# EAGLE design icetube (EAGLE 5.01)
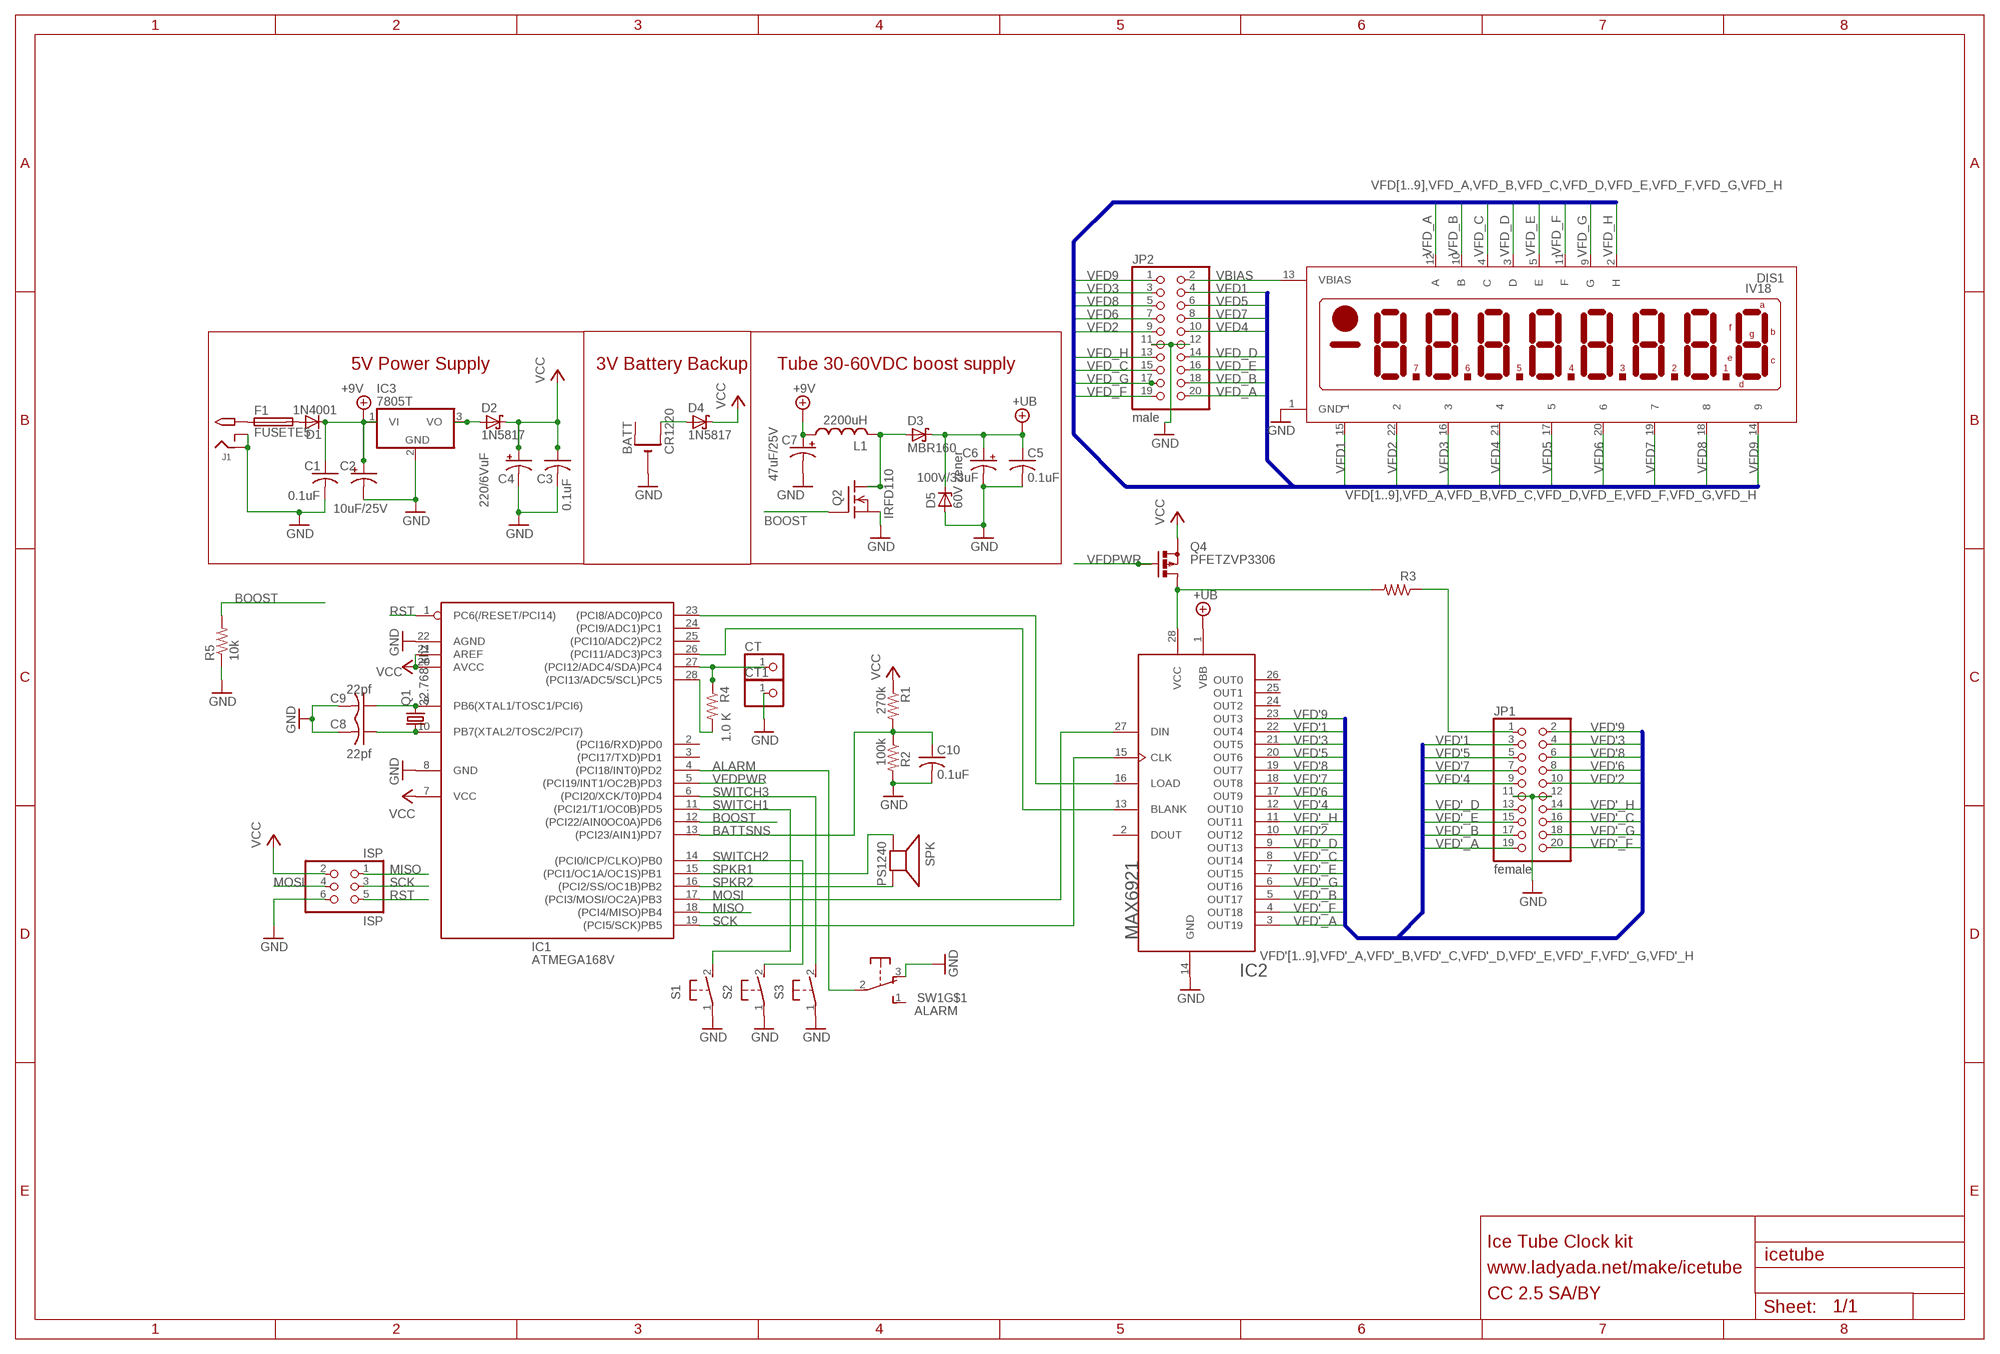
[diagram p0: schematic, sheet 1]

## Parts
BATT  CR1220  CR1220THM  [CR1220-THM]
C1  0.1uF  C-US025-025X050  [C025-025X050]
C2  10uF/25V  CPOL-USE2.5-6  [E2,5-6]
C3  0.1uF  C-US025-025X050  [C025-025X050]
C4  220/6VuF  CPOL-USE2.5-6  [E2,5-6]
C5  0.1uF  C-US025-024X044  [C025-024X044]
C6  100V/33uF  CPOL-USE3.5-8  [E3,5-8]
C7  47uF/25V  CPOL-USE2.5-6  [E2,5-6]
C8  22pf  C-US025-025X050  [C025-025X050]
C9  22pf  C-US025-025X050  [C025-025X050]
C10  0.1uF  C-US025-024X044  [C025-024X044]
CT  PINHD-1X1  [1X01]
CT1  PINHD-1X1  [1X01]
D1  1N4001  1N4004  [DO41-10]
D2  1N5817  SCHOTTKY-DIODEDO41  [DO41-10]
D3  MBR160  SCHOTTKY-DIODEDO41  [DO41-10]
D4  1N5817  SCHOTTKY-DIODEDO41  [DO41-10]
D5  60V zener  ZENER-DIODEDO41Z10  [DO41Z10]
DIS1  IV18  [IV18]
F1  FUSETE5  [TE5]
IC1  ATMEGA168V  ATMEGA168PROUND  [DIL28/3]
IC2  MAX6921  [PLCC-S28]
IC3  7805T  [TO220H]
ISP  ISP  PINHD-2X3  [2X03]
J1  2.1MMJACK  [PJ-102A]
JP1  female  PINHD-2X10  [2X10]
JP2  male  PINHD-2X10  [2X10]
L1  2200uH  L  [6000]
Q1  32.768 khz  CRYTALTC26V  [TC26V]
Q2  IRFD110  [DIL04]
Q4  PFETZVP3306  [TO92-OVAL]
R1  270k  R-US_0207/10  [0207/10]
R2  100k  R-US_0207/10  [0207/10]
R3  22  R-US_0207/10  [0207/10]
R4  1.0 K  R-US_0207/5V  [0207/5V]
R5  10k  R-US_0207/5V  [0207/5V]
S1  31-XX  [B3F-31XX]
S2  31-XX  [B3F-31XX]
S3  31-XX  [B3F-31XX]
SPK  PS1240  SPEAKER/PS12  [PS12]
SW1  ALARM  OS102011MA1Q  [OS102011MA1Q]

## Nets
+9V: C1.1 C2.+ C7.+ D1.C IC3.1(VI) L1.1
+UB: C5.1 C6.+ D3.C D5.C IC2.1(VBB)
ALARM: IC1.4((PCI18/INT0)PD2) SW1.2(P)
BATTSNS: C10.1 IC1.13((PCI23/AIN1)PD7) R1.2 R2.1
BLANK: IC1.26((PCI11/ADC3)PC3) IC2.13(BLANK)
BOOST: IC1.12((PCI22/AIN0OC0A)PD6) Q2.3(G) R5.2
GND: BATT.- C1.2 C2.- C3.2 C4.- C5.2 C6.- C7.- C8.2 C9.2 C10.2 CT1.1 D5.A DIS1.1(GND) IC1.8(GND) IC1.22(AGND) IC2.14(GND) IC3.2(GND) ISP.6 J1.RING J1.RING_SW JP1.11 JP1.12 JP2.11 JP2.12 Q2.4(S) R2.2 R5.1 S1.1(P) S2.1(P) S3.1(P) SW1.3(O)
LOAD: IC1.23((PCI8/ADC0)PC0) IC2.16(LOAD)
MISO: IC1.18((PCI4/MISO)PB4) ISP.1
MOSI: IC1.17((PCI3/MOSI/OC2A)PB3) IC2.27(DIN) ISP.4
N$1: C9.1 IC1.9(PB6(XTAL1/TOSC1/PCI6)) Q1.2
N$2: D3.A L1.2 Q2.1(D) Q2.2(D1)
N$3: C8.1 IC1.10(PB7(XTAL2/TOSC2/PCI7)) Q1.1
N$4: F1.1 J1.TIP
N$5: D1.A F1.2
N$10: BATT.+2(+1) D4.A
N$11: IC1.28((PCI13/ADC5/SCL)PC5) R4.2
N$34: JP1.1 R3.1
N$39: IC2.28(VCC) Q4.3(D) R3.2
N$52: CT.1 IC1.27((PCI12/ADC4/SDA)PC4) R4.1
N$53: D2.A IC3.3(VO)
RST: IC1.1(PC6(/RESET/PCI14)) ISP.5
SCK: IC1.19((PCI5/SCK)PB5) IC2.15(CLK) ISP.3
SPKR1: IC1.15((PCI1/OC1A/OC1S)PB1) SPK.P$1(+)
SPKR2: IC1.16((PCI2/SS/OC1B)PB2) SPK.P$2(-)
SWITCH1: IC1.11((PCI21/T1/OC0B)PD5) S1.2(S)
SWITCH2: IC1.14((PCI0/ICP/CLKO)PB0) S2.2(S)
SWITCH3: IC1.6((PCI20/XCK/T0)PD4) S3.2(S)
VBIAS: DIS1.13(VBIAS) JP2.2
VCC: C3.1 C4.+ D2.C D4.C IC1.7(VCC) IC1.20(AVCC) IC1.21(AREF) ISP.2 Q4.1(S) R1.1
VFD1: DIS1.15 JP2.4
VFD2: DIS1.22 JP2.9
VFD3: DIS1.16 JP2.3
VFD4: DIS1.21 JP2.10
VFD5: DIS1.17 JP2.6
VFD6: DIS1.20 JP2.7
VFD7: DIS1.19 JP2.8
VFD8: DIS1.18 JP2.5
VFD9: DIS1.14 JP2.1
VFD'1: IC2.22(OUT4) JP1.3
VFD'2: IC2.10(OUT12) JP1.10
VFD'3: IC2.21(OUT5) JP1.4
VFD'4: IC2.12(OUT10) JP1.9
VFD'5: IC2.20(OUT6) JP1.5
VFD'6: IC2.17(OUT9) JP1.8
VFD'7: IC2.18(OUT8) JP1.7
VFD'8: IC2.19(OUT7) JP1.6
VFD'9: IC2.23(OUT3) JP1.2
VFD'_A: IC2.3(OUT19) JP1.19
VFD'_B: IC2.5(OUT17) JP1.17
VFD'_C: IC2.8(OUT14) JP1.16
VFD'_D: IC2.9(OUT13) JP1.13
VFD'_E: IC2.7(OUT15) JP1.15
VFD'_F: IC2.4(OUT18) JP1.20
VFD'_G: IC2.6(OUT16) JP1.18
VFD'_H: IC2.11(OUT11) JP1.14
VFD_A: DIS1.12(A) JP2.20
VFD_B: DIS1.10(B) JP2.18
VFD_C: DIS1.4(C) JP2.15
VFD_D: DIS1.3(D) JP2.14
VFD_E: DIS1.5(E) JP2.16
VFD_F: DIS1.11(F) JP2.19
VFD_G: DIS1.9(G) JP2.17
VFD_H: DIS1.2(H) JP2.13
VFDPWR: IC1.5((PCI19/INT1/OC2B)PD3) Q4.2(G)
Unconnected: BATT.+1(+) IC1.2((PCI16/RXD)PD0) IC1.3((PCI17/TXD)PD1) IC1.24((PCI9/ADC1)PC1) IC1.25((PCI10/ADC2)PC2) IC2.2(DOUT) IC2.24(OUT2) IC2.25(OUT1) IC2.26(OUT0) SW1.1(S) SW1.MT1(MT) SW1.MT2(MT)

## Buses
VFD[1..9],VFD_A,VFD_B,VFD_C,VFD_D,VFD_E,VFD_F,VFD_G,VFD_H
VFD'[1..9],VFD'_A,VFD'_B,VFD'_C,VFD'_D,VFD'_E,VFD'_F,VFD'_G,VFD'_H

## Notes on the sheet
- 5V Power Supply | 3V Battery Backup | Tube 30-60VDC boost supply
- Ice Tube Clock kit
- www.ladyada.net/make/icetube
- CC 2.5 SA/BY

## Library data of the parts
BATT = vfd:CR1220
C1 C3 C8 C9 = minimidi:C-US: CAPACITOR, American symbol
C2 C4 C7 = minimidi:CPOL-US: POLARIZED CAPACITOR, American symbol
C5 C10 = rcl-ez:C-US: CAPACITOR, American symbol
C6 = rcl-ez:CPOL-US: POLARIZED CAPACITOR, American symbol
CT CT1 = ybox2:PINHD-1X1: PIN HEADER
D1 = minimidi:1N4004: DIODE general purpose rectifier, 1 A
D2-D4 = usbbuck:SCHOTTKY-DIODE: Schottky Diode
D5 = diode:ZENER-DIODE: Z-Diode
DIS1 = vfd:IV18: LCD DISPLAY 8-character 7 segment
F1 = fuse:FUSE: Fuse
IC1 = avr:ATMEGA168*P: MICROCONTROLLER 16 kBytes FLASH 1 kBytes SRAM 512 Bytes EEPROM USART 8-channel 10 bit ADC
IC2 = vfd:MAX6921
IC3 = linear:78*: Positive VOLTAGE REGULATOR
ISP = pinhead-ez:PINHD-2X3: PIN HEADER
J1 = minimidi:2.1MMJACK
JP1 JP2 = pinhead:PINHD-2X10: PIN HEADER
L1 = usbbuck:L
Q1 = crystal:CRYTAL: CRYSTAL
Q2 = vfd:IRFD110
Q4 = adafruit:PFET: P-CHANNEL MOS FET
R1-R5 = minimidi:R-US_: RESISTOR, American symbol
S1-S3 = switch-omron:31-XX: OMRON SWITCH
SPK = ybox2:SPEAKER: SPEAKER Source: Buerklin
SW1 = adaprog:OS102011MA1Q

## Board
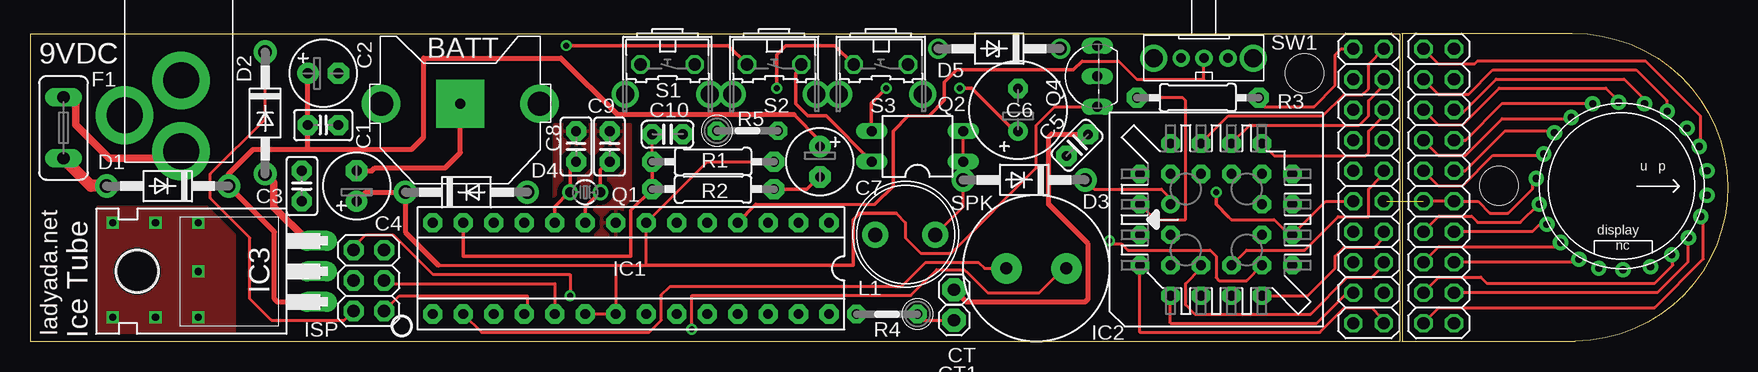
[diagram p1: board, top side]
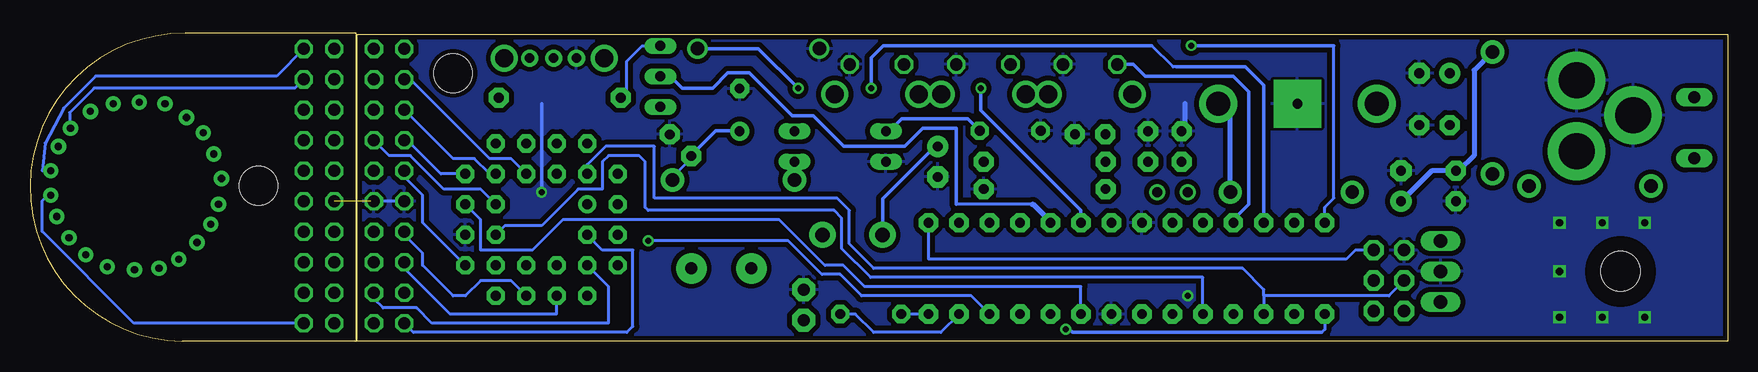
[diagram p2: board, bottom side, seen from below]

Size 141.47 x 25.68 mm. Coordinates in mm from the lower left corner, seen from the top.
Outline: 114.34,25.65 114.34,0
Outline: 114.3,0.03 128.77,0.03 arc180 128.52,25.68 114.3,25.68
Outline: 0,0.04 114.2,0.04 114.2,25.62 0,25.62 0,0.04
Copper layers (1*16): Top 0.035mm / dielectric 1.5mm / Bottom 0.035mm
Design rules "default *": minimum track width 10mil, minimum drill 19mil, track to track 12mil, track to pad 12mil, pad to pad 20mil, via to via 12mil, smd to smd 0mil, copper to edge 12mil, drill to drill 8mil, minimum pad ring 10mil, minimum via ring 8mil, stop-mask expansion 4mil, vias tented up to drill 20mil, thermal gap 10mil
Holes 3.2 mm at 106.21,22.35 122.42,12.98

### Footprints (pad centres in the part's own frame; a part is rotated, then mirrored left to right if it is on the bottom)
CR1220-THM = drill 2 pad 3.175 round: +1 -6.604,0; +2 6.604,0 | drill 0.8 pad 3.962 square: - 0,0
C025-025X050 = drill 0.813 pad 1.676 octagon: 1 -1.27,0; 2 1.27,0
E2,5-6 = drill 0.813 pad 1.778 round: + -1.27,0 | drill 0.813 pad 1.778 octagon: - 1.27,0
C025-024X044 = drill 0.813 pad 1.676 octagon: 1 -1.27,0; 2 1.27,0
E3,5-8 = drill 0.813 pad 1.6 round: + -1.778,0 | drill 0.813 pad 1.6 octagon: - 1.778,0
1X01 = drill 1.016 pad 1.93 octagon: 1 0,0
DO41-10 = drill 1.118 pad 1.93 round: A 5.08,0; C -5.08,0
DO41Z10 = drill 1.118 round: A 5.08,0; C -5.08,0
IV18 = drill 0.6 pad 1.27 round: 1 -0.635,-7.112; 2 1.524,-6.858; 3 3.175,-6.223; 4 4.699,-5.08; 5 6.096,-3.556; 6 6.858,-1.905; 7 6.985,0.127; 8 6.731,2.413; 9 5.715,4.191; 10 4.318,5.588; 11 2.54,6.604; 12 0.762,7.112; 13 -1.27,7.112; 14 -3.302,6.477; 15 -4.826,5.461; 16 -6.223,3.81; 17 -6.858,1.905; 18 -6.985,-0.254; 19 -6.858,-2.413; 20 -5.715,-4.191; 21 -4.445,-5.588; 22 -2.667,-6.477
TE5 = drill 1.016 long: 1 -2.54,0; 2 2.54,0
DIL28/3 = drill 0.813 pad 1.6 octagon: 1 -16.51,-3.81; 2 -13.97,-3.81; 3 -11.43,-3.81; 4 -8.89,-3.81; 5 -6.35,-3.81; 6 -3.81,-3.81; 7 -1.27,-3.81; 8 1.27,-3.81; 9 3.81,-3.81; 10 6.35,-3.81; 11 8.89,-3.81; 12 11.43,-3.81; 13 13.97,-3.81; 14 16.51,-3.81; 15 16.51,3.81; 16 13.97,3.81; 17 11.43,3.81; 18 8.89,3.81; 19 6.35,3.81; 20 3.81,3.81; 21 1.27,3.81; 22 -1.27,3.81; 23 -3.81,3.81; 24 -6.35,3.81; 25 -8.89,3.81; 26 -11.43,3.81; 27 -13.97,3.81; 28 -16.51,3.81
PLCC-S28 = drill 0.813 pad 1.524 round: 1 1.27,3.81 | drill 0.813 pad 1.524 octagon: 2 -1.27,6.35; 3 -1.27,3.81; 4 -3.81,6.35; 5 -6.35,3.81; 6 -3.81,3.81; 7 -6.35,1.27; 8 -3.81,1.27; 9 -6.35,-1.27; 10 -3.81,-1.27; 11 -6.35,-3.81; 12 -3.81,-6.35; 13 -3.81,-3.81; 14 -1.27,-6.35; 15 -1.27,-3.81; 16 1.27,-6.35; 17 1.27,-3.81; 18 3.81,-6.35; 19 6.35,-3.81; 20 3.81,-3.81; 21 6.35,-1.27; 22 3.81,-1.27; 23 6.35,1.27; 24 3.81,1.27; 25 6.35,3.81; 26 3.81,6.35; 27 3.81,3.81; 28 1.27,6.35
TO220H = drill 1.118 long: 1 -2.54,-10.16; 2 0,-10.16; 3 2.54,-10.16 | hole 3.302: 0,4.826
2X03 = drill 1.016 pad 1.676 octagon: 1 -2.54,-1.27; 2 -2.54,1.27; 3 0,-1.27; 4 0,1.27; 5 2.54,-1.27; 6 2.54,1.27
PJ-102A = drill 3 pad 4.8 round: RING 0.1,-3.39; RING_SW -4.6,-6.29; TIP 0.1,-9.29
2X10 = drill 1.016 octagon: 1 -11.43,-1.27; 2 -11.43,1.27; 3 -8.89,-1.27; 4 -8.89,1.27; 5 -6.35,-1.27; 6 -6.35,1.27; 7 -3.81,-1.27; 8 -3.81,1.27; 9 -1.27,-1.27; 10 -1.27,1.27; 11 1.27,-1.27; 12 1.27,1.27; 13 3.81,-1.27; 14 3.81,1.27; 15 6.35,-1.27; 16 6.35,1.27; 17 8.89,-1.27; 18 8.89,1.27; 19 11.43,-1.27; 20 11.43,1.27
6000 = drill 1.2 pad 2.184 round: 1 -2.5,0; 2 2.5,0
TC26V = drill 0.813 round: 1 -1.27,0; 2 1.27,0
DIL04 = drill 0.813 long: 1 -1.27,-3.81; 2 1.27,-3.81; 3 1.27,3.81; 4 -1.27,3.81
TO92-OVAL = drill 0.813 long: 1 -2.54,0; 2 0,0; 3 2.54,0
0207/10 = drill 0.813 pad 1.676 octagon: 1 -5.08,0; 2 5.08,0
0207/5V = drill 0.813 pad 1.524 octagon: 1 -2.54,0; 2 2.54,0
B3F-31XX = drill 1.016 octagon: 1 -2.261,-1.245; 2 2.261,-1.245 | drill 1.499 pad 2.159 round: 3 -3.505,1.245; 4 3.505,1.245
PS12 = drill 1 pad 2.54 round: P$1 -2.5,0; P$2 2.5,0
OS102011MA1Q = drill 0.8 pad 1.422 round: 1 -2,0; 2 0,0; 3 1.9,0 | drill 1.5 pad 2.184 round: MT1 -4.1,0; MT2 4.2,0

### Placement (x,y rotation side)
BATT  35.86,19.81 0 top
C1  24.43,18.03 0 top
C2  24.43,22.35 0 top
C3  22.65,12.95 270 top
C4  27.22,12.95 90 top
C5  87.27,16.36 45 top
C6  82.34,19.3 90 top
C7  65.83,14.99 270 top
C8  45.51,16.26 90 top
C9  48.3,16.26 90 top
C10  53.13,17.27 0 top
CT  77,1.78 0 top
CT1  77,4.32 0 top
D1  11.47,12.95 180 top
D2  19.6,19.05 270 top
D3  82.85,13.46 180 top
D4  36.36,12.45 0 top
D5  80.77,24.41 180 top
DIS1  132.63,12.95 270 top
F1  2.79,17.81 270 top
IC1  50.08,6.1 180 top
IC2  98.85,10.16 90 top
IC3  13.76,5.84 90 top
ISP  28.24,5.08 90 top
J1  12.49,25.15 0 top
JP1  111.55,12.95 270 top
JP2  117.39,12.95 270 top
L1  72.94,8.89 0 top
Q1  46.27,12.45 0 top
Q2  73.96,16.26 90 top
Q4  88.94,22.1 90 top
R1  56.92,14.99 180 top
R2  56.92,12.7 0 top
R3  97.32,20.32 180 top
R4  71.42,2.29 180 top
R5  59.79,17.56 0 top
S1  53.13,21.84 180 top
S2  62.02,21.84 180 top
S3  70.91,21.84 180 top
SPK  83.86,6.1 180 top
SW1  97.83,23.62 180 top

### Tracks (layer width: path | path; a pad name or v marks a point on that pad's centre or on a via)
+9V
  Top 0.305: 63.65,18.92 65.78,16.79
  Top 0.406: C2.+ C1.1 23.16,16 | 23.16,16 31.79,16 32.81,17.02 32.81,23.62 44.24,23.62 48.94,18.92 63.65,18.92 | IC3.1 20.62,3.3 20.36,3.56 20.36,9.14 D1.C 16.55,13.97 18.58,16 23.16,16 | C7.+ 65.81,16.26 65.78,16.28 65.78,16.79
  Bottom 0.254: 70.4,8.89 L1.1
  Bottom 0.305: C7.+ 66.01,16.26 66.04,16.28 70.4,11.92 70.4,8.89
+UB  (via drill 0.5)
  Top 0.254: D3.C 88.69,12.7 94.28,12.7 95.04,11.94 IC2.1
  Top 0.305: C6.+ 82.34,17.34 82.29,17.3 78.48,21.11 v77.47,21.11
  Bottom 0.254: 87.93,13.21 D3.C 87.93,13.72 | 87.93,13.72 87.93,13.91 | 86.4,15.49 C5.1 86.37,15.27 87.93,13.72
  Bottom 0.305: C6.+ 82.36,17.55 84.34,17.55 86.4,15.49 | D5.C 80.77,24.41 v77.47,21.11
ALARM
  Top 0.254: 60.49,11.43 70.4,11.43 | 87.67,23.37 90.72,23.37 92.24,21.84 97.83,21.84 SW1.2 | 73.19,18.8 74.9,18.8 74.93,18.82
  Top 0.305: 73.19,18.8 71.92,17.53 71.92,12.95 70.4,11.43 | IC1.4 60.49,11.43 | 87.67,23.37 86.94,22.63 77.21,22.63 76.2,21.62 76.2,20.09 74.93,18.82
BATTSNS
  Top 0.254: C10.1 51.86,14.99 R1.2
  Top 0.305: IC1.13 36.11,7.11 50.08,7.11 50.08,10.92 51.86,12.7 R2.1 | R2.1 51.84,12.46 | R2.1 R1.2
BLANK  (via drill 0.5)
  Top 0.254: IC2.13 101.39,5.08 99.1,5.08 98.85,5.33 98.85,7.11 98.34,7.62 91.48,7.62 90.97,8.13 89.96,8.13 v89.96,8.38
  Bottom 0.254: IC1.26 63.03,3.81 72.18,3.81 73.96,5.59 75.48,5.59 78.27,8.38 v89.96,8.38
BOOST  (via drill 0.5)
  Top 0.305: Q2.3 70.1,17.48 70.1,17.3 70.1,19.84 v71.37,21.11
  Top 0.406: Q2.3 70.1,17.53 70.1,17.3
  Bottom 0.254: 45.97,22.89 46.22,22.89 48,24.66
  Bottom 0.305: IC1.12 38.65,21.34 40.2,22.89 45.97,22.89 | 48,24.66 70.35,24.66 71.37,23.65 v71.37,21.11 | R5.2 63.34,18.57 68.83,18.57 69.84,17.55 70.12,17.55 Q2.3
GND  (via drill 0.5, 0.6)  (1 unrouted)
  Top 0.254: IC1.22 51.35,2.03 | 64.3,23.09 S2.1 64.25,23.11 | v45,3.81 45,5.59 33.57,5.59 30.27,8.89 27.98,8.89 26.97,7.87 ISP.6 | JP1.11 107.99,11.68 IC2.14 104.94,8.89 103.67,10.16 100.12,10.16 99.86,10.41 | 118.69,11.71 118.87,11.71 | 118.69,11.71 JP2.12 120.67,11.68 121.66,10.69 123.19,10.69 125.22,12.73 125.22,13.23 125.52,13.53 DIS1.1 | JP2.11 116.15,11.71 118.69,11.71
  Top 0.305: 64.25,23.11 64.05,23.11 64.05,22.61 63.8,22.35 63.8,19.81 64.81,18.8 66.34,18.8 Q2.4 | 99.86,10.41 98.85,11.43 v98.85,12.45 | C7.- 65.81,13.72 65.78,13.74 64.74,12.7 R2.2
  Top 0.406: CT1.1 78.02,3.3 87.93,3.3 88.18,3.56 88.18,8.13 84.88,11.43 84.88,17.02 85.13,17.27 88.18,17.27 | 88.18,17.27 88.43,17.27 | 88.18,17.27 C5.2 | C4.- 28.49,14.22 28.74,14.48 34.59,14.48 35.86,15.75 BATT.-
  Bottom 0.254: 113.07,11.68 JP1.12 JP1.11
  Bottom 0.305: v98.85,12.45 98.85,19.81
  Bottom 0.406: C8.2 45.21,17.53 45.21,19.84
  other vias: 6.9,9.91 10.46,9.91 14.01,9.91 14.01,5.84 14.01,2.03 10.46,2.03 6.9,2.03
  pour Bottom (isolate 0.406): -0.62,25.65 -0.62,0 113.83,0.25 114.09,25.91
  pour Top: 5.63,11.18 5.63,0.76 17.06,0.76 17.06,8.89 14.77,11.18
  pour Top (isolate 0.406): 43.68,18.06 43.68,8.92 50.03,8.92 50.03,18.06
LOAD
  Bottom 0.254: 105.45,11.68 IC2.16 103.93,10.16 103.93,7.62 99.61,7.62 97.07,10.16 79.04,10.16 75.23,6.35 73.7,6.35 71.92,4.57 53.89,4.57 IC1.23
MISO
  Top 0.254: IC1.18 41.44,2.29 41.44,3.81 30.78,3.81 ISP.1
MOSI
  Bottom 0.254: 38.65,3.81 IC1.17 | 38.65,3.81 38.65,4.32 40.43,6.1 71.16,6.1 73.19,8.13 73.19,10.92 74.21,11.94 89.45,11.94 89.45,16.26 93.51,16.26 95.04,14.73 IC2.27 | ISP.4 28.24,3.81 38.65,3.81
N$1
  Top 0.305: IC1.9 46.27,11.25 47.47,12.45 Q1.2 47.54,14.3 48.25,15.01 48.28,14.99 C9.1
N$2
  Top 0.254: L1.2 77.77,11.22 D3.A | Q2.1 Q2.2
  Bottom 0.254: D3.A Q2.1
N$3
  Top 0.305: C8.1 45.49,14.99 45.46,15.01 45,14.55 Q1.1 44.98,12.45 44.95,12.47 43.73,11.25 IC1.10
N$4
  Top 0.61: J1.TIP 12,15.27 6.6,15.27 3.81,18.06 3.81,20.09 3.3,20.6 2.79,20.6 F1.1
N$5
  Top 1.016: D1.A 6.37,12.98 5.08,12.98 F1.2
N$10
  Bottom 0.406: BATT.+2 41.44,19.81 D4.A
N$11
  Bottom 0.254: IC1.28 R4.2
N$34
  Top 0.254: JP1.1 109.26,24.38 108.75,23.88 108.75,21.34 107,19.58 102.87,19.58 102.36,20.09 102.36,20.35 102.38,20.35 R3.1
N$39
  Top 0.254: IC2.28 93.77,10.16 96.31,10.16 96.31,20.07 96.05,20.32 R3.2
  Bottom 0.254: 92.12,20.19 R3.2 91.74,20.83 91.74,23.37 90.47,24.64 Q4.3
N$52
  Top 0.254: R4.1 73.96,1.78 CT.1
  Bottom 0.254: IC1.27 65.57,0.76 71.16,0.76 72.69,2.29 R4.1
N$53
  Top 0.61: IC3.3 23.13,8.38 20.32,11.2 20.32,13.23 19.6,13.95 D2.A
RST
  Bottom 0.254: 66.59,9.65 66.59,9.4 | 66.59,9.65 IC1.1 | 66.59,9.65 66.59,6.86 31.79,6.86 31.03,7.62 ISP.5
SCK
  Top 0.254: IC1.19 43.73,4.83 29.76,4.83 ISP.3
  Bottom 0.254: IC1.19 43.73,5.33 71.42,5.33 73.83,7.75 73.83,10.29 74.46,10.92 89.96,10.92 90.21,11.18 90.21,14.99 90.72,15.49 93.26,15.49 93.77,14.99 93.77,12.7 95.8,12.7 98.85,9.65 101.9,9.65 IC2.15
SPKR1  (via drill 0.5)
  Top 0.254: 86.4,6.1 SPK.P$1 86.15,6.1 84.12,4.06 79.8,4.06 78.02,5.84 78,5.84 77.85,5.99 75.56,5.99 73.4,3.84 55.16,3.84 v55.16,1.02
  Bottom 0.254: 33.82,0.76 33.57,1.02 IC1.15 | 54.6,0.79 54.83,1.02 v55.16,1.02
  Bottom 0.305: v55.16,1.02 54.88,1.02 54.86,1.04 54.58,0.76 33.82,0.76
SPKR2
  Top 0.254: IC1.16 37.63,0.76 51.6,0.76 52.62,1.78 52.62,3.81 52.6,3.81 52.57,3.84 53.34,4.6 72.64,4.6 74.65,6.6 79.04,6.6 79.54,6.1 SPK.P$2
SWITCH1
  Bottom 0.305: 41.19,10.16 39.92,11.43 39.92,20.83 41.19,22.1 48.56,22.1 49.55,23.09 S1.2 | IC1.11 41.19,10.16 | 41.19,10.16 41.44,9.91
SWITCH2  (via drill 0.5)
  Top 0.305: S2.2 58.18,24.66 v44.7,24.66
  Bottom 0.254: IC1.14 33.57,11.18 32.81,11.94 32.81,24.64
  Bottom 0.305: 32.81,24.64 32.83,24.66 v44.7,24.66
SWITCH3  (via drill 0.5)
  Top 0.305: S3.2 67.07,24.66 62.99,24.66 62.22,23.9 v62.22,21.11
  Bottom 0.305: IC1.6 53.89,10.92 54.4,11.43 62.01,19.04 62.22,19.26 v62.22,21.11 62.48,21.11
VBIAS
  Bottom 0.254: JP2.2 120.92,22.12 136.01,22.12 138.68,19.46 140.2,16.54 140.46,14.25 139.77,14.25 DIS1.13
VCC
  Top 0.254: IC1.20 IC1.21 48.81,6.35 | 48.81,6.35 51.35,6.35 IC1.7 56.43,14.99 R1.1 | 34.08,6.35 48.81,6.35 | 72.18,10.67 72.94,9.91 72.94,8.64 74.21,7.37 76.75,7.37 83.86,14.48 83.86,18.03 85.39,19.56 Q4.1 | ISP.2 26.2,1.78 20.11,1.78 18.33,3.56 18.33,8.64 15.03,11.94 15.03,13.97 19.6,18.54 D2.C
  Top 0.305: 72.18,10.67 69.13,10.67 68.62,10.16 68.62,6.35 51.35,6.35 | 34.08,6.35 34.06,6.35 34.03,6.38
  Top 0.406: 34.03,6.38 31.28,9.12 D4.C 27.98,12.45 C4.+
  Bottom 0.254: IC1.7 51.1,9.91 51.1,10.16
  Bottom 0.406: C4.+ 24.68,14.22 C3.1 22.39,14.22 21.12,15.49 21.12,22.61 D2.C
VFD1
  Bottom 0.254: JP2.4 119.4,21.11 136.14,21.11 138.17,19.08 138.17,17.86 DIS1.15
VFD2
  Top 0.254: JP2.9 117.37,12.98 119.38,12.98 121.92,15.52 126.23,15.52 126.23,15.54 DIS1.22
VFD3
  Top 0.254: JP2.3 117.37,20.6 119.88,20.6 121.92,22.63 133.85,22.63 136.39,20.09 136.39,19.33 136.44,19.28 DIS1.16
VFD4
  Top 0.254: JP2.10 119.6,14.22 122.93,17.55 127.19,17.55 | 127.19,17.55 127.25,17.55 | 127.19,17.55 DIS1.21
VFD5
  Top 0.254: DIS1.17 134.56,19.84 134.62,19.84 134.62,20.09 132.84,21.87 122.17,21.87 119.38,19.08 119.12,19.08 118.87,19.33 118.84,19.3 JP2.6
VFD6
  Top 0.254: JP2.7 117.37,15.52 119.63,15.52 122.68,18.57 128.52,18.57 128.52,18.59 DIS1.20
VFD7
  Top 0.254: DIS1.19 130.19,19.84 122.68,19.84 119.63,16.79 118.87,16.79 118.84,16.76 JP2.8
VFD8
  Top 0.254: JP2.5 117.37,18.06 119.38,18.06 122.42,21.11 131.31,21.11 132.33,20.09 132.33,19.89 | 132.33,19.89 132.33,19.84 | 132.33,19.89 DIS1.18
VFD9
  Top 0.254: JP2.1 117.37,23.14 120.39,23.14 120.65,23.39 134.62,23.39 139.19,18.82 139.19,16.28 139.13,16.28 DIS1.14
VFD'1
  Bottom 0.254: IC2.22 101.39,15.24 103.17,15.24 109.77,21.84 JP1.3
VFD'2
  Top 0.254: IC2.10 101.39,7.62 106.21,7.62 109.01,10.41 111.55,10.41 111.55,12.7 112.56,13.72 112.56,14.22 JP1.10
VFD'3
  Top 0.254: IC2.21 101.64,18.03 110.79,18.03 111.55,18.8 111.55,20.07 112.82,21.34 JP1.4
VFD'4
  Bottom 0.254: IC2.12 108.75,9.91 108.75,12.19 110.28,13.72 JP1.9
VFD'5
  Bottom 0.254: JP1.5 106.21,15.24 104.44,15.24 103.17,13.97 IC2.20
VFD'6
  Bottom 0.254: IC2.17 103.93,12.7 106.98,12.7 109.77,15.49 111.55,15.49 JP1.8 113.07,16.76
VFD'7
  Bottom 0.254: IC2.18 107.23,13.97 110.02,16.76 JP1.7
VFD'8
  Top 0.254: IC2.19 103.67,15.49 111.29,15.49 111.55,15.75 111.55,17.53 112.82,18.8 JP1.6
VFD'9
  Top 0.254: IC2.23 99.86,18.8 107.74,18.8 109.52,20.57 111.04,20.57 111.55,21.08 111.55,23.11 JP1.2
VFD'_A
  Bottom 0.254: JP1.19 109.52,0.76 91.74,0.76 91.23,1.27 91.23,7.62 93.77,7.62 IC2.3
VFD'_B
  Top 0.254: IC2.5 95.04,1.52 107.23,1.52 109.77,4.06 JP1.17
VFD'_C
  Top 0.254: IC2.8 97.58,6.1 96.31,4.83 96.31,3.05 97.07,2.29 106.72,2.29 109.77,5.33 111.8,5.33 112.82,6.35 JP1.16
VFD'_D
  Bottom 0.254: IC2.9 101.39,5.08 103.93,5.08 105.2,3.81 106.21,3.81 108.75,6.35 108.75,7.37 110.53,9.14 JP1.13
VFD'_E
  Bottom 0.254: IC2.7 97.58,2.29 106.47,2.29 110.28,6.1 JP1.15
VFD'_F
  Top 0.254: IC2.4 92.5,0.76 107.48,0.76 109.52,2.79 111.8,2.79 112.56,2.03 112.56,1.78 JP1.20
VFD'_G
  Bottom 0.254: IC2.6 93.26,4.57 93.26,1.52 107.99,1.52 109.26,2.79 112.06,2.79 112.82,3.56 JP1.18
VFD'_H
  Top 0.254: IC2.11 106.47,3.81 108.75,6.1 108.75,7.11 109.52,7.87 112.06,7.87 112.82,8.64 JP1.14
VFD_A
  Bottom 0.254: JP2.20 132.81,1.52 140.46,9.17 140.46,11.71 139.95,12.22 139.92,12.19 DIS1.12
VFD_B
  Top 0.254: JP2.18 118.69,4.09 135.63,4.09 138.17,6.63 138.17,8.66 138.19,8.66 DIS1.10
VFD_C
  Top 0.254: JP2.15 117.42,7.9 127.76,7.9 127.76,8.05 DIS1.4
VFD_D
  Top 0.254: JP2.14 118.69,9.17 125.22,9.17 125.73,9.68 126.31,9.68 DIS1.3
VFD_E
  Top 0.254: DIS1.5 128.84,6.63 118.69,6.63 JP2.16
VFD_F
  Top 0.254: JP2.19 117.42,2.82 135.38,2.82 139.44,6.88 139.44,10.21 DIS1.11
VFD_G
  Top 0.254: JP2.17 117.42,5.36 120.9,5.36 121.41,4.85 135.38,4.85 136.9,6.38 136.9,7.16 DIS1.9
VFD_H
  Top 0.254: JP2.13 117.42,10.44 120.14,10.44 120.65,9.93 124.2,9.93 125.73,11.46 125.75,11.46 DIS1.2
VFDPWR
  Bottom 0.254: 57.95,11.43 64.29,11.43
  Bottom 0.305: 64.29,11.43 64.29,17.78 67.08,17.78 68.58,16.28 73.66,16.28 76.2,18.82 77.97,18.82 81.53,22.38 83.31,22.38 84.58,21.11 87.12,21.11 88.26,22.25 | 88.26,22.25 88.64,21.87 89.4,21.87 89.15,22.12 88.92,22.12 | 88.26,22.25 88.13,22.38 | 88.92,22.12 88.9,22.12 | 88.92,22.12 Q4.2
  Bottom 0.406: IC1.5 56.41,9.91 56.38,9.93 57.88,11.43 57.95,11.43

### Text on the board
tPlace: 9VDC | ladyada.net | Ice Tube